# Altium schematic sheet Ethernet Interface (ETH).SchDoc
size A4; SheetNumber: 9; SheetTotal: 10
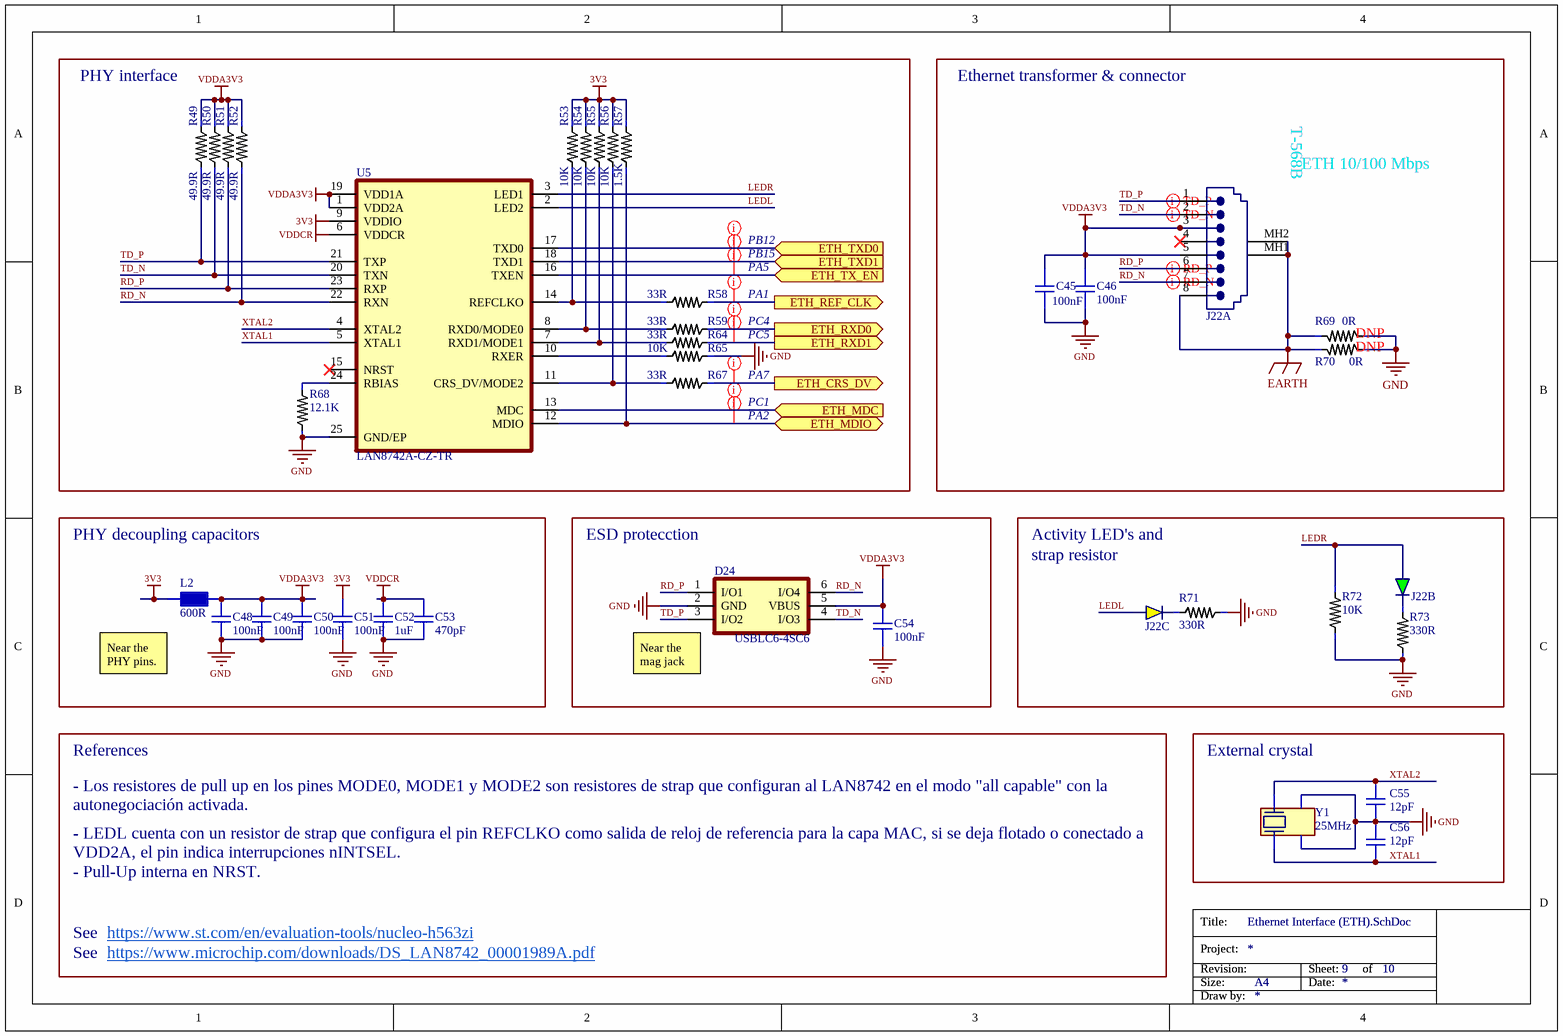
[diagram p0: Ethernet Interface (ETH).SchDoc]

## Parts
C45  value 100nF  [CAPC1005N]  (hidden comment: Multilayer Ceramic Capacitors)
C46  value 100nF  [CAPC1005N]  (hidden comment: Multilayer Ceramic Capacitors)
C48  value 100nF  [CAPC1005N]  (hidden comment: Multilayer Ceramic Capacitors)
C49  value 100nF  [CAPC1005N]  (hidden comment: Multilayer Ceramic Capacitors)
C50  value 100nF  [CAPC1005N]  (hidden comment: Multilayer Ceramic Capacitors)
C51  value 100nF  [CAPC1005N]  (hidden comment: Multilayer Ceramic Capacitors)
C52  value 1uF  [CAPC1005N]  (hidden comment: Multilayer Ceramic Capacitors)
C53  value 470pF  [CAPC1005N]  (hidden comment: Multilayer Ceramic Capacitors)
C54  value 100nF  [CAPC1005N]  (hidden comment: Multilayer Ceramic Capacitors)
C55  value 12pF  [CAPC1005N]  (hidden comment: Multilayer Ceramic Capacitors)
C56  value 12pF  [CAPC1005N]  (hidden comment: Multilayer Ceramic Capacitors)
D24  Part Number: USBLC6-4SC6  [SOT95P280X145-6N]  (hidden comment: ESD Protection Diodes)
J22  Magnetic Jack Ethernet  [RJ45-8P8C-VERT-THT-MAGJACK]  (value not drawn)  (parts A,B,C of 3)
L2  value 600R  [INDC1005N]  (hidden comment: Ferrite Beads)
R49  value 49.9R  [RESC1005N]  (hidden comment: Thick Film Resistors)
R50  value 49.9R  [RESC1005N]  (hidden comment: Thick Film Resistors)
R51  value 49.9R  [RESC1005N]  (hidden comment: Thick Film Resistors)
R52  value 49.9R  [RESC1005N]  (hidden comment: Thick Film Resistors)
R53  value 10K  [RESC1005N]  (hidden comment: Thick Film Resistors)
R54  value 10K  [RESC1005N]  (hidden comment: Thick Film Resistors)
R55  value 10K  [RESC1005N]  (hidden comment: Thick Film Resistors)
R56  value 10K  [RESC1005N]  (hidden comment: Thick Film Resistors)
R57  value 1.5K  [RESC1005N]  (hidden comment: Thick Film Resistors)
R58  value 33R  [RESC1005N]  (hidden comment: Thick Film Resistors)
R59  value 33R  [RESC1005N]  (hidden comment: Thick Film Resistors)
R64  value 33R  [RESC1005N]  (hidden comment: Thick Film Resistors)
R65  value 10K  [RESC1005N]  (hidden comment: Thick Film Resistors)
R67  value 33R  [RESC1005N]  (hidden comment: Thick Film Resistors)
R68  value 12.1K  [RESC1005N]  (hidden comment: Thick Film Resistors)
R69  value 0R  [RESC1005N]  (hidden comment: Thick Film Resistors)  (no BOM)
R70  value 0R  [RESC1005N]  (hidden comment: Thick Film Resistors)  (no BOM)
R71  value 330R  [RESC1005N]  (hidden comment: Thick Film Resistors)
R72  value 10K  [RESC1005N]  (hidden comment: Thick Film Resistors)
R73  value 330R  [RESC1005N]  (hidden comment: Thick Film Resistors)
U5  Part Number: LAN8742A-CZ-TR  [QFN50P400X400X100-25N-D]  (hidden comment: Ethernet PHY)
Y1  value 25MHz  [XTAL3225]  (hidden comment: Crystal)

## Blocks framed on the sheet
PHY interface: R49-R59 R64 R65 R67 R68 U5
PHY decoupling capacitors: C48-C53 L2
ESD protecction: C54 D24
External crystal: C55 C56 Y1

## Ports
ETH_CRS_DV (out, see Main[2B], Microcontroller (MCU)[2A]), ETH_MDC (in, see Main[2B], Microcontroller (MCU)[2C]), ETH_MDIO (bidir, see Main[2B], Microcontroller (MCU)[2A]), ETH_REF_CLK (out, see Main[2B], Microcontroller (MCU)[2A]), ETH_RXD0 (out, see Main[2B], Microcontroller (MCU)[2C]), ETH_RXD1 (out, see Main[2B], Microcontroller (MCU)[2C]), ETH_TX_EN (in, see Main[2B], Microcontroller (MCU)[2A]), ETH_TXD0 (in, see Main[2B], Microcontroller (MCU)[2B]), ETH_TXD1 (in, see Main[2B], Microcontroller (MCU)[2C])

## Nets
3V3: C51.1 L2.1 R53.2 R54.2 R55.2 R56.2 R57.2 U5.9(VDDIO)
EARTH: J22.8 J22.MH1 J22.MH2 R69.2 R70.2
GND: C45.2 C46.2 C48.2 C49.2 C50.2 C51.2 C52.2 C53.2 C54.2 C55.2 C56.1 D24.2(GND) R65.2 R68.1 R69.1 R70.1 R71.2 R72.1 R73.1 U5.25(GND/EP) Y1.2(GND) Y1.4(GND)
VDDA3V3: C45.1 C46.1 C48.1 C49.1 C50.1 C54.1 D24.5(VBUS) J22.3 J22.5 L2.2 R49.2 R50.2 R51.2 R52.2 U5.1(VDD2A) U5.19(VDD1A)
VDDCR: C52.1 C53.1 U5.6(VDDCR)
ETH_CRS_DV: R67.2 ; port ETH_CRS_DV
ETH_MDC: U5.13(MDC) ; port ETH_MDC
ETH_MDIO: R57.1 U5.12(MDIO) ; port ETH_MDIO
ETH_REF_CLK: R58.2 ; port ETH_REF_CLK
ETH_RXD0: R59.2 ; port ETH_RXD0
ETH_RXD1: R64.2 ; port ETH_RXD1
ETH_TX_EN: U5.16(TXEN) ; port ETH_TX_EN
ETH_TXD0: U5.17(TXD0) ; port ETH_TXD0
ETH_TXD1: U5.18(TXD1) ; port ETH_TXD1
LEDL: J22.12 U5.2(LED2)
LEDR: J22.9 R72.2 U5.3(LED1)
RD_N: D24.6(I/O4) J22.7 R52.1 U5.22(RXN)
RD_P: D24.1(I/O1) J22.6 R51.1 U5.23(RXP)
TD_N: D24.4(I/O3) J22.2 R50.1 U5.20(TXN)
TD_P: D24.3(I/O2) J22.1 R49.1 U5.21(TXP)
XTAL1: C56.2 U5.5(XTAL1) Y1.3(OUT/IN)
XTAL2: C55.1 U5.4(XTAL2) Y1.1(IN/OUT)
NetJ22_10: J22.10 R73.2
NetJ22_11: J22.11 R71.1
NetR53_1: R53.1 R58.1 U5.14(REFCLKO)
NetR54_1: R54.1 R59.1 U5.8(RXD0/MODE0)
NetR55_1: R55.1 R64.1 U5.7(RXD1/MODE1)
NetR56_1: R56.1 R67.1 U5.11(CRS_DV/MODE2)
NetR65_1: R65.1 U5.10(RXER)
NetR68_2: R68.2 U5.24(RBIAS)

Not connected (* = marked no-connect by the designer): J22 4*; U5 15(NRST)*

## Layout directives
net class RMII: ETH_CRS_DV, ETH_MDC, ETH_MDIO, ETH_REF_CLK, ETH_RXD0, ETH_RXD1, ETH_TX_EN, ETH_TXD0, ETH_TXD1
differential pair; differential pair class MDI_TD: TD_N, TD_P
differential pair; differential pair class MDI_RD: RD_N, RD_P

## Notes on the sheet
- Ethernet transformer & connector
- (near J22) ETH 10/100 Mbps
- (near J22) T-568B
- PB12
- PA1
- PB15
- PA5
- PA7
- PC4
- PC5
- (near R69) DNP
- DNP
- PC1
- PA2
- Activity LED's and
- strap resistor
- Near the PHY pins.
- (near D24) Near the mag jack
- References
- - Los resistores de pull up en los pines MODE0, MODE1 y MODE2 son resistores de strap que configuran al LAN8742 en el modo "all capable" con la autonegociación activada.
- - LEDL cuenta con un resistor de strap que configura el pin REFCLKO como salida de reloj de referencia para la capa MAC, si se deja flotado o conectado a VDD2A, el pin indica interrupciones nINTSEL.
- - Pull-Up interna en NRST.
- Title:
- See
- https://www.microchip.com/downloads/DS_LAN8742_00001989A.pdf <https://ww1.microchip.com/downloads/aemDocuments/documents/OTH/ProductDocuments/DataSheets/DS_LAN8742_00001989A.pdf>
- https://www.st.com/en/evaluation-tools/nucleo-h563zi
- Project:
- Revision:
- Size:
- A4
- Sheet:
- Date:
- of
- Draw by:

## Library data of the parts
C45 C46 C48-C51 C54 = C-MLCC-100nF-50V-10%-0402: Multilayer Ceramic Capacitors MLCC - SMD/SMT 50 V 0.1uF X7R 0402 10%; Part Number: CC0402KRX5R9BB104; Manufacturer: YAGEO; Mounting Type: SMT; Mouser Part #: 603-CC402KRX5R9BB104; Digikey Part #: 311-3342-1-ND; JLCPCB Part #: C105882
C52 = C-MLCC-1uF-50V-10%-0402: Multilayer Ceramic Capacitors MLCC - SMD/SMT 50V 1uF X5R 0402 10% HI CV; Part Number: CC0402KRX5R9BB105; Manufacturer: YAGEO; Mounting Type: SMT; Mouser Part #: 603-CC0402KX5R9BB105; Digikey Part #: 13-CC0402KRX5R9BB105CT-ND; JLCPCB Part #: C7500380
C53 = C-MLCC-470pF-50V-10%-0402: Multilayer Ceramic Capacitors MLCC - SMD/SMT 50 V 470pF X7R 0402 10%; Part Number: CC0402KRX7R9BB471; Manufacturer: YAGEO; Mounting Type: SMT; Mouser Part #: 603-CC402KRX7R9BB471; Digikey Part #: 311-1028-1-ND; JLCPCB Part #: C106207
C55 C56 = C-MLCC-12pF-50V-10%-0402: Multilayer Ceramic Capacitors MLCC - SMD/SMT 50 V 12 pF C0G 0402 1%; Part Number: CC0402FRNPO9BN120; Manufacturer: YAGEO; Mounting Type: SMT; Mouser Part #: 603-CC402FRNPO9BN120; Digikey Part #: 311-1641-1-ND; JLCPCB Part #: C326662
D24 = D-USBLC6-4SC6: ESD Protection Diodes / TVS Diodes Low Cap ESD Protect; Manufacturer: STMicroelectronics; Mounting Type: SMT; Mouser Part #: 511-USBLC6-4SC6; Digikey Part #: 497-4492-1-ND; JLCPCB Part #: C558419
J22 = J-RJ45-1P-VERT-MAGJACK-SH-LED-THT: Modular Ethernet Connector Jack (Female) 1x1 Shielded Through Hole With LEDs With Magnetics; Manufacturer: HANRUN; Part Number: HY951180A; Mounting Type: THT; Mouser Part #: 815-ARJ07-111071A; Digikey Part #: 535-12607-ND; JLCPCB Part #: C34677
L2 = L-FB-600R-100MHz-500mA-0402: Ferrite Beads 600 OHM 25% Alternate Sizing Guide Below; Manufacturer: Murata Electronics; Part Number: BLM15AX601SN1D; Mounting Type: SMT; Mouser Part #: 81-BLM15AX601SN1D; Digikey Part #: 490-5441-1-ND; JLCPCB Part #: C76886
R49-R52 = R-THICK-49R9-62.5mW-1%-0402: Thick Film Resistors - SMD General Purpose Chip Resistor 0402, 49.9Ohms, 1%, 1/16W; Part Number: RC0402FR-0749R9L; Manufacturer: YAGEO; Mounting Type: SMT; Mouser Part #: 603-RC0402FR-0749R9L; Digikey Part #: 311-49.9LRCT-ND; JLCPCB Part #: C87044
R53-R56 R65 R72 = R-THICK-10K-62.5mW-1%-0402: Thick Film Resistors - SMD General Purpose Chip Resistor 0402, 10kOhms, 1%, 1/16W; Part Number: RC0402FR-0710KL; Manufacturer: YAGEO; Mounting Type: SMT; Mouser Part #: 603-RC0402FR-0710KL; Digikey Part #: 311-10.0KLRCT-ND; JLCPCB Part #: C60490
R57 = R-THICK-1K5-62.5mW-1%-0402: Thick Film Resistors - SMD General Purpose Chip Resistor 0402, 1.5kOhms, 1%, 1/16W; Part Number: RC0402FR-071K5L; Manufacturer: YAGEO; Mounting Type: SMT; Mouser Part #: 603-RC0402FR-071K5L; Digikey Part #: 311-1.50KLRCT-ND; JLCPCB Part #: C114759
R58 R59 R64 R67 = R-THICK-33R-62.5mW-1%-0402: Thick Film Resistors - SMD General Purpose Chip Resistor 0402, 33Ohms, 1%, 1/16W; Part Number: RC0402FR-0733RL; Manufacturer: YAGEO; Mounting Type: SMT; Mouser Part #: 603-RC0402FR-0733RL; Digikey Part #: 311-33.0LRCT-ND; JLCPCB Part #: C138002
R68 = R-THICK-12K1-62.5mW-1%-0402: Thick Film Resistors - SMD General Purpose Chip Resistor 0402, 12.1kOhms, 1%, 1/16W; Part Number: RC0402FR-0712K1L; Manufacturer: YAGEO; Mounting Type: SMT; Mouser Part #: 603-RC0402FR-0712K1L; Digikey Part #: 311-12.1KLRCT-ND; JLCPCB Part #: C132157
R69 R70 = R-THICK-0R-62.5mW-1%-0402: Thick Film Resistors - SMD General Purpose Chip Resistor 0402, 0Ohms, 1%, 1/16W; Part Number: RC0402FR-070RL; Manufacturer: YAGEO; Mounting Type: SMT; Mouser Part #: 603-RC0402FR-070RL; Digikey Part #: 311-0.0LRCT-ND; JLCPCB Part #: C106231
R71 R73 = R-THICK-330R-62.5mW-1%-0402: Thick Film Resistors - SMD General Purpose Chip Resistor 0402, 330Ohms, 1%, 1/16W; Part Number: RC0402FR-07330RL; Manufacturer: YAGEO; Mounting Type: SMT; Mouser Part #: 603-RC0402FR-07330RL; Digikey Part #: 311-330LRCT-ND; JLCPCB Part #: C105875
U5 = U-LAN8742A: Ethernet PHY transceiver 10/100-Mbps; Manufacturer: Microchip; Mounting Type: SMT; Mouser Part #: 579-LAN8742A-CZ-TR; Digikey Part #: LAN8742A-CZ-CT-ND; JLCPCB Part #: C621424
Y1 = Y-XTAL-25MHz-12pF-20ppm-3225-SMT: Crystals 25MHz 12pF 20ppm -40C +125C; Manufacturer: ECS; Part Number: ECS-250-12-33Q-JES-TR; Mounting Type: SMT; Mouser Part #: 520-250-12-33Q-JEST; Digikey Part #: XC2151CT-ND; JLCPCB Part #: C91750